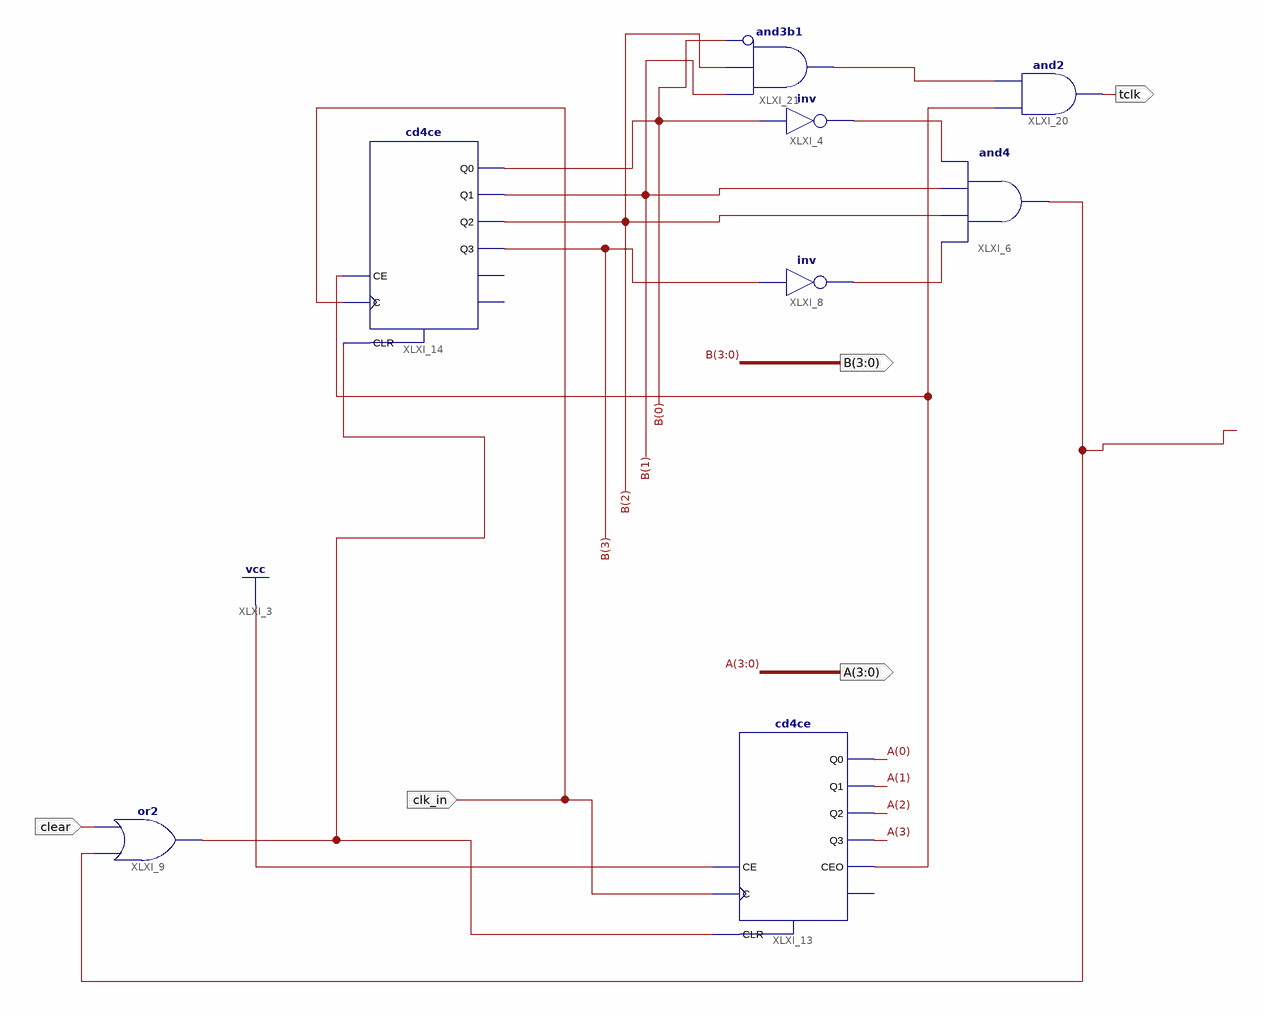
[diagram p0: schematic sheet 1]
// Xilinx ISE schematic sec_counter.sch (spartan6) as structural Verilog: 8 symbols, 5 ports
module sec_counter (
  input  clk_in,
  input  clear,
  output [3:0] A,
  output [3:0] B,
  output tclk
);

  wire tc, XLXN_15, XLXN_26, XLXN_54, XLXN_73, XLXN_75;

  not XLXI_4 (XLXN_15, B[0]);
  not XLXI_8 (XLXN_26, B[3]);
  and XLXI_6 (tc, XLXN_26, B[2], B[1], XLXN_15);
  or XLXI_9 (XLXN_54, tc, clear);
  cd4ce XLXI_13 (
    .C(clk_in), .CE(1'b1), .CLR(XLXN_54), .CEO(XLXN_73), .Q0(A[0]), .Q1(A[1]), .Q2(A[2]), .Q3(A[3]));  // open: TC
  cd4ce XLXI_14 (.C(clk_in), .CE(XLXN_73), .CLR(XLXN_54), .Q0(B[0]), .Q1(B[1]), .Q2(B[2]), .Q3(B[3]));  // open: CEO, TC
  and XLXI_20 (tclk, XLXN_75, XLXN_73);
  and XLXI_21 (XLXN_75, ~B[0], B[2], B[1]);  // and3b1
endmodule
